# Altium schematic sheet 47. XDS110 DEBUGGER.SchDoc: XDS110 DEBUGGER (part 1 of 3)
size 513 x 386 mm; Project: PROC154E2(001)_SK_AM69; Issue: 1.0; RevCode: E3; Page Create Date: March  8, 1995; Variant Name: Core Design; Schematic Page Number: 47; Page Number: 47; Page Size: C; Comment: MISTRAL_TITLEBLK_CSIZE_1; Page Count: 62; Schematic Page Count: 62; Name: PROC154E2 001 SK AM69; DsnPath: C:\Users\danie\Downloads\sprr466c\PROC154E3_RP\PROC154E3_SCH.DSN; SchematicName: SCHEMATIC1; PageName: 47. XDS110 DEBUGGER; PageSize: C; TopSchematic: True
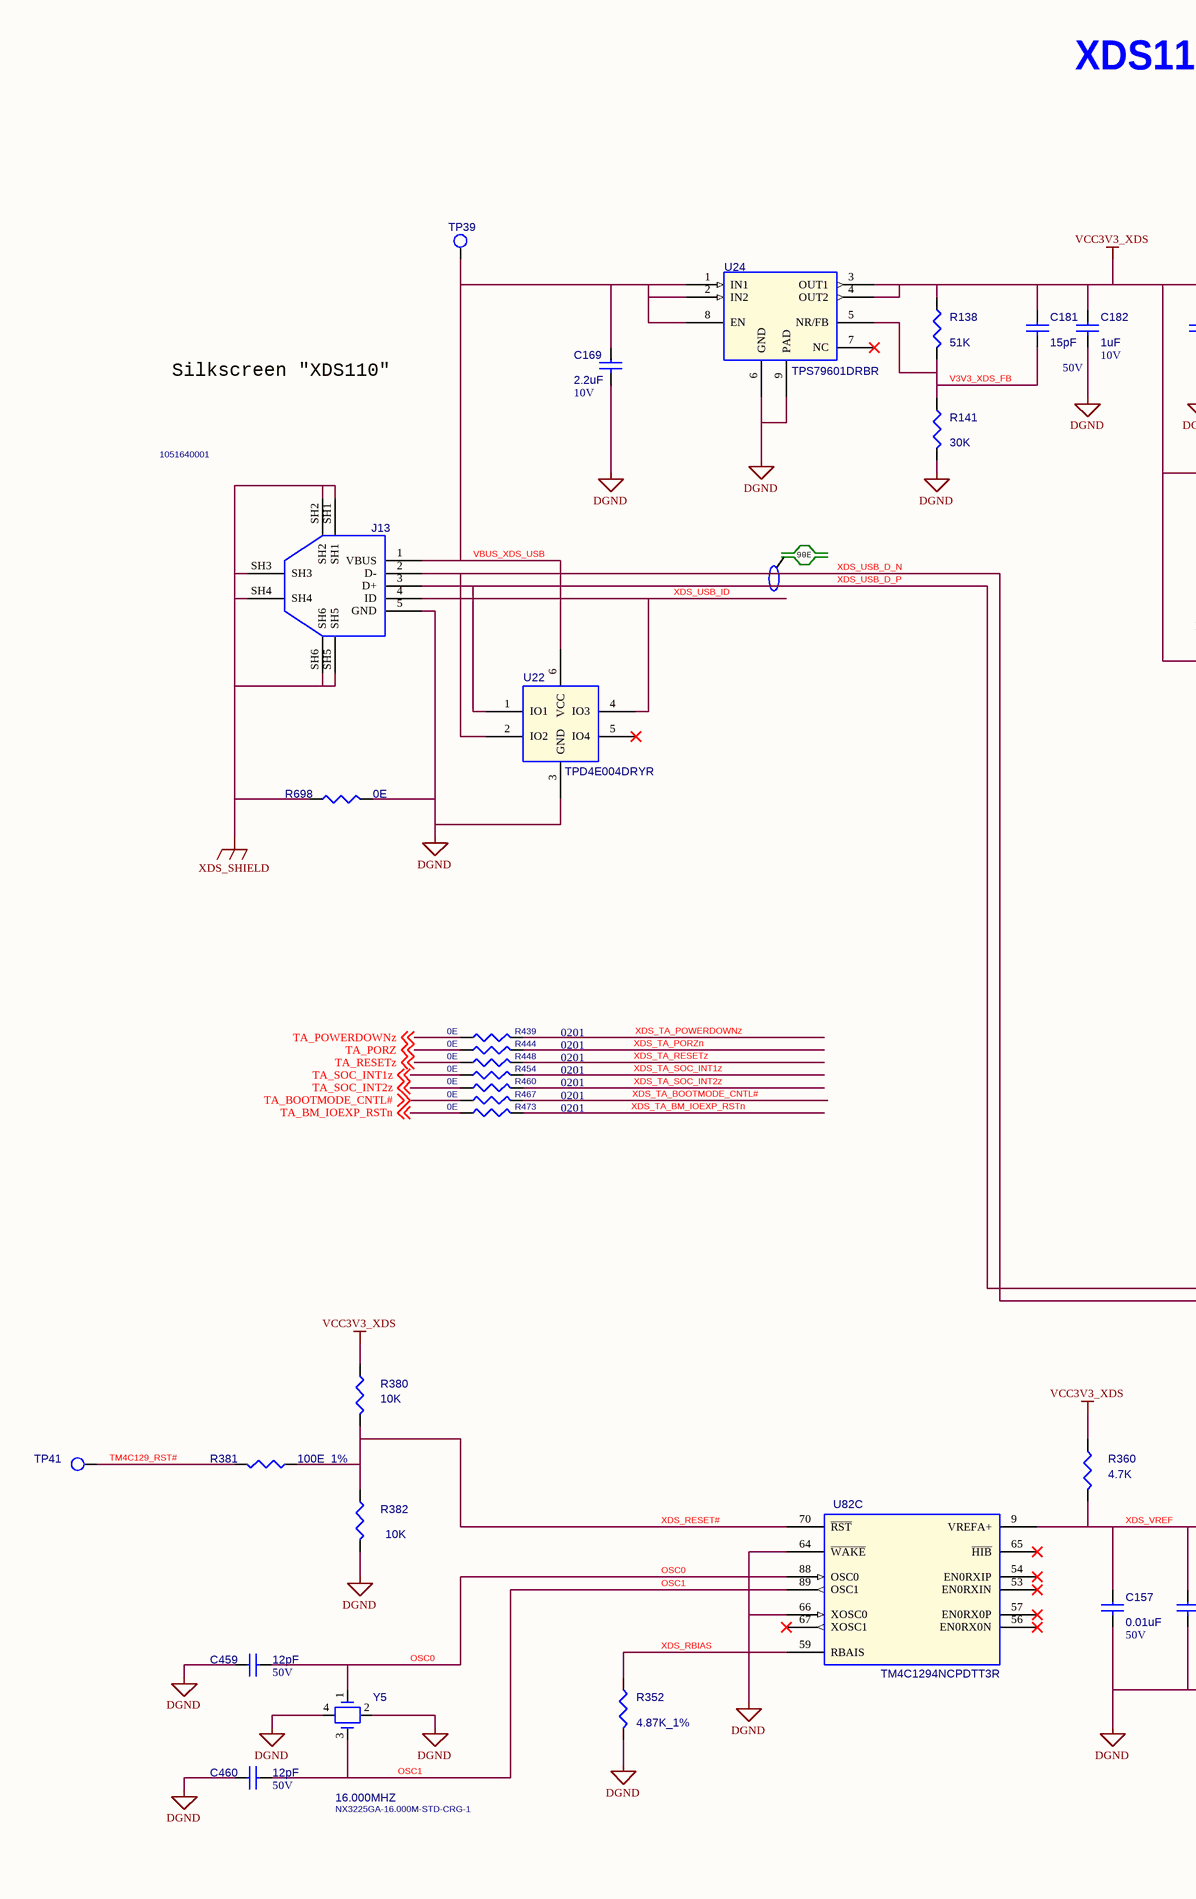
[diagram p0: 47. XDS110 DEBUGGER.SchDoc, left]
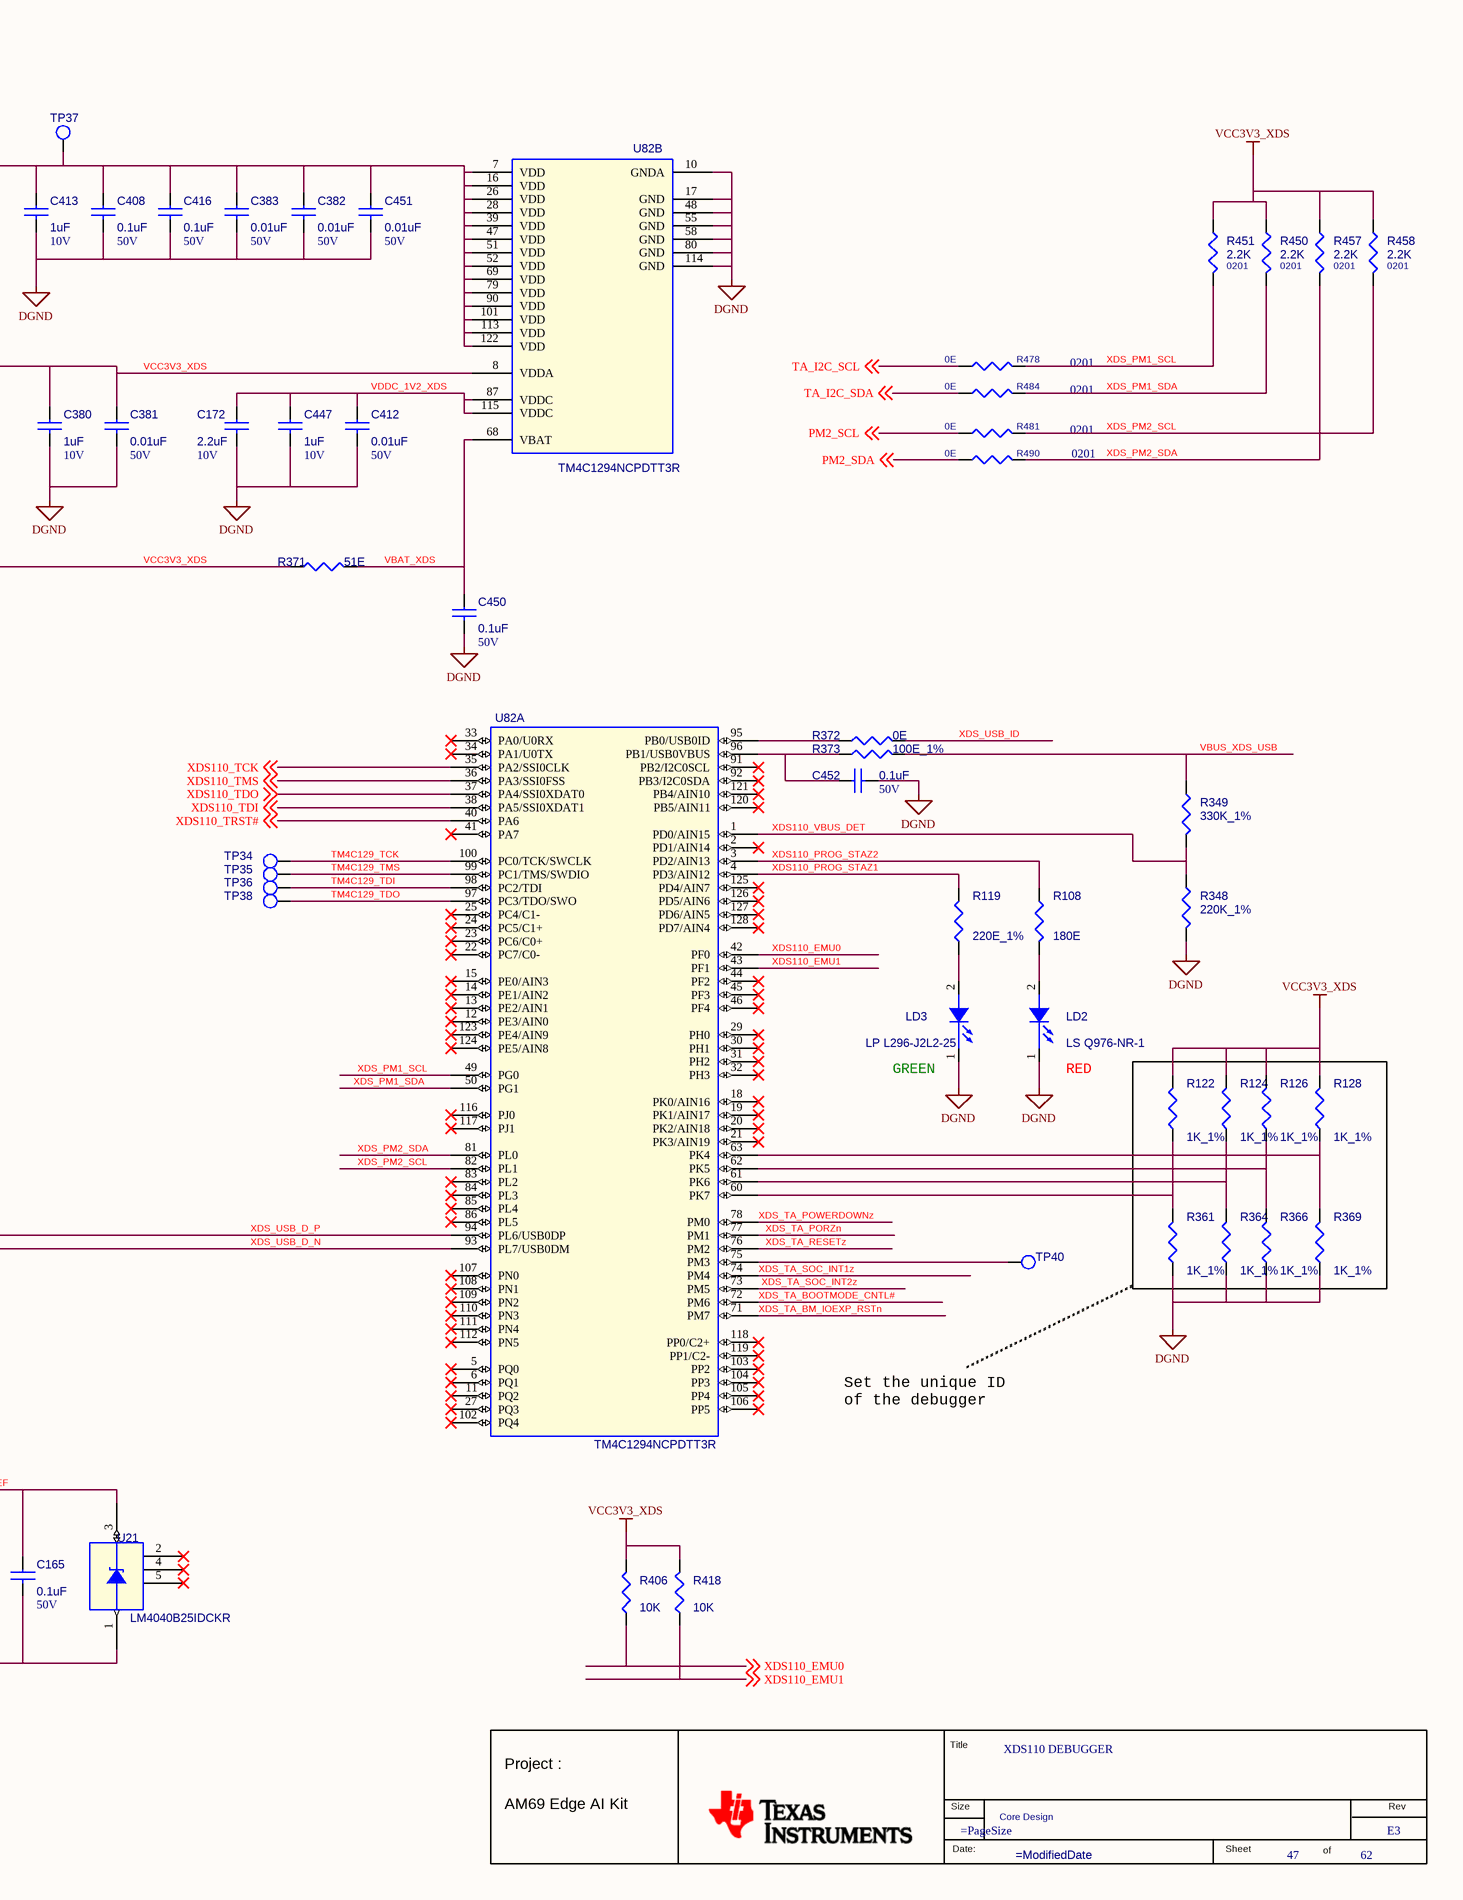
[diagram p1: 47. XDS110 DEBUGGER.SchDoc, right]

## Parts
*  RevCode: E3  Title: XDS110 DEBUGGER  Page Number: 47  Page Count: 62  Variant Name: Core Design  (hidden comment: MISTRAL_TITLEBLK_CSIZE_1)  (graphical)
C157  0.01uF  Voltage: 50V  [CAP0402_0-75]
C165  0.1uF  Voltage: 50V  [CAP0402_0-75]
C169  2.2uF  Voltage: 10V  [CAP0603_1]
C172  2.2uF  Voltage: 10V  [CAP0603_1]
C181  15pF  Voltage: 50V  [CAP0402_0-75]
C182  1uF  Voltage: 10V  [CAP0402_0-75]
C380  1uF  Voltage: 10V  [CAP0402_0-75]
C381  0.01uF  Voltage: 50V  [CAP0402_0-75]
C382  0.01uF  Voltage: 50V  [CAP0402_0-75]
C383  0.01uF  Voltage: 50V  [CAP0402_0-75]
C408  0.1uF  Voltage: 50V  [CAP0402_0-75]
C412  0.01uF  Voltage: 50V  [CAP0402_0-75]
C413  1uF  Voltage: 10V  [CAP0402_0-75]
C416  0.1uF  Voltage: 50V  [CAP0402_0-75]
C447  1uF  Voltage: 10V  [CAP0402_0-75]
C450  0.1uF  Voltage: 50V  [CAP0402_0-75]
C451  0.01uF  Voltage: 50V  [CAP0402_0-75]
C452  0.1uF  Voltage: 50V  [CAP0402_0-75]
C459  12pF  Voltage: 50V  [CAP0402_0-75]
C460  12pF  Voltage: 50V  [CAP0402_0-75]
J13  Mfr_part_number: 1051640001  [CON_MUSBB5_1051640001_S_R_S_2-5]  (hidden comment: CON_MUSB-B_5_F)
LD2  LS Q976-NR-1  [LED_0603_0-8]
LD3  LP L296-J2L2-25  [LED_0603_0-7]
R108  180E  [RES0402_0-5]
R119  220E_1%  [RES0402_0-5]
R122  1K_1%  [RES0402_0-5]
R124  1K_1%  [RES0402_0-5]
R126  1K_1%  [RES0402_0-5]
R128  1K_1%  [RES0402_0-5]
R138  51K  [RES0402_0-5]
R141  30K  [RES0402_0-5]
R348  220K_1%  [RES0402_0-5]
R349  330K_1%  [RES0402_0-5]
R352  4.87K_1%  [RES0402_0-5]
R360  4.7K  [RES0402_0-5]
R361  1K_1%  [RES0402_0-5]
R364  1K_1%  [RES0402_0-5]
R366  1K_1%  [RES0402_0-5]
R369  1K_1%  [RES0402_0-5]
R371  51E  [RES0402_0-5]
R372  0E  [RES0402_0-5]
R373  100E_1%  [RES0402_0-5]
R380  10K  [RES0402_0-5]
R381  100E_1%  [RES0402_0-5]
R382  10K  [RES0402_0-5]
R406  10K  [RES0402_0-5]
R418  10K  [RES0402_0-5]
R439  0E  Package: 0201  [RES0201_0-5]
R444  0E  Package: 0201  [RES0201_0-5]
R448  0E  Package: 0201  [RES0201_0-5]
R450  2.2K  Package: 0201  [RES0201_0-5]
R451  2.2K  Package: 0201  [RES0201_0-5]
R454  0E  Package: 0201  [RES0201_0-5]
R457  2.2K  Package: 0201  [RES0201_0-5]
R458  2.2K  Package: 0201  [RES0201_0-5]
R460  0E  Package: 0201  [RES0201_0-5]
R467  0E  Package: 0201  [RES0201_0-5]
R473  0E  Package: 0201  [RES0201_0-5]
R478  0E  Package: 0201  [RES0201_0-5]
R481  0E  Package: 0201  [RES0201_0-5]
R484  0E  Package: 0201  [RES0201_0-5]
R490  0E  Package: 0201  [RES0201_0-5]
R698  0E  [RES0805_0-75]
TP34  TP30_SMD  [TP30_SMD]  (value not drawn)
TP35  TP30_SMD  [TP30_SMD]  (value not drawn)
TP36  TP30_SMD  [TP30_SMD]  (value not drawn)
TP37  TP30_SMD  [TP30_SMD]  (value not drawn)
TP38  TP30_SMD  [TP30_SMD]  (value not drawn)
TP39  TP30_SMD  [TP30_SMD]  (value not drawn)
TP40  TP30_SMD  [TP30_SMD]  (value not drawn)
TP41  TP30_SMD  [TP30_SMD]  (value not drawn)
U21  LM4040B25IDCKR  [SC70-5_1-1]
U22  TPD4E004DRYR  [SON6_19-68_40X60_PB_0-6]
U24  TPS79601DRBR  [SON8_25-59_130X130_1]
U82  TM4C1294NCPDTT3R  [TQFP128_15-74_550X550_1-2]  (parts A,B,C of 3)
Y5  16.000MHZ  Mfr_part_number: NX3225GA-16.000M-STD-CRG-1  [XTAL4_NX3225GA_130X100_SMD_0-9]

## Nets
DGND: C157.2 C165.2 C169.2 C172.2 C182.2 C380.2 C381.2 C382.2 C383.2 C408.2 C412.2 C413.2 C416.2 C447.2 C450.2 C451.2 C452.2 C459.1 C460.1 J13.5(GND) LD2.1(CATHODE) LD3.1(CATHODE) R141.2 R348.2 R352.2 R361.1 R364.1 R366.1 R369.1 R382.2 R698.2 U21.1(ANODE) U22.3(GND) U24.6(GND) U24.9(PAD) U82.10(GNDA) U82.17(GND) U82.48(GND) U82.55(GND) U82.58(GND) U82.64(~{WAKE}) U82.66(XOSC0) U82.80(GND) U82.114(GND) Y5.2 Y5.4
VCC3V3_XDS: C181.1 C182.1 C380.1 C381.1 C382.1 C383.1 C408.1 C413.1 C416.1 C451.1 R122.2 R124.2 R126.2 R128.2 R138.1 R360.1 R371.1 R380.1 R406.2 R418.2 R450.1 R451.1 R457.1 R458.1 TP37.1(TP) U24.3(OUT1) U24.4(OUT2) U82.7(VDD) U82.8(VDDA) U82.16(VDD) U82.26(VDD) U82.28(VDD) U82.39(VDD) U82.47(VDD) U82.51(VDD) U82.52(VDD) U82.69(VDD) U82.79(VDD) U82.90(VDD) U82.101(VDD) U82.113(VDD) U82.122(VDD)
XDS_SHIELD: J13.SH1 J13.SH2 J13.SH3 J13.SH4 J13.SH5 J13.SH6 R698.1
OSC0: C459.2 U82.88(OSC0) Y5.1
OSC1: C460.2 U82.89(OSC1) Y5.3
PM2_SCL: R481.2 ; off-sheet PM2_SCL
PM2_SDA: R490.2 ; off-sheet PM2_SDA
TA_BM_IOEXP_RSTn: R473.2 ; off-sheet TA_BM_IOEXP_RSTn
TA_BOOTMODE_CNTL#: R467.2 ; off-sheet TA_BOOTMODE_CNTL#
TA_I2C_SCL: R478.2 ; off-sheet TA_I2C_SCL
TA_I2C_SDA: R484.2 ; off-sheet TA_I2C_SDA
TA_PORZ: R444.2 ; off-sheet TA_PORZ
TA_POWERDOWNz: R439.2 ; off-sheet TA_POWERDOWNz
TA_RESETz: R448.2 ; off-sheet TA_RESETz
TA_SOC_INT1z: R454.2 ; off-sheet TA_SOC_INT1z
TA_SOC_INT2z: R460.2 ; off-sheet TA_SOC_INT2z
TM4C129_RST#: R381.2 TP41.1(TP)
TM4C129_TCK: TP34.1(TP) U82.100(PC0/TCK/SWCLK)
TM4C129_TDI: TP36.1(TP) U82.98(PC2/TDI)
TM4C129_TDO: TP38.1(TP) U82.97(PC3/TDO/SWO)
TM4C129_TMS: TP35.1(TP) U82.99(PC1/TMS/SWDIO)
V3V3_XDS_FB: C181.2 R138.2 R141.1 U24.5(NR/FB)
VBAT_XDS: C450.1 R371.2 U82.68(VBAT)
VBUS_XDS_USB: C169.1 J13.1(VBUS) R349.1 R373.2 TP39.1(TP) U22.6(VCC) U24.1(IN1) U24.2(IN2) U24.8(EN)
VDDC_1V2_XDS: C172.1 C412.1 C447.1 U82.87(VDDC) U82.115(VDDC)
XDS110_EMU0: R406.1 U82.42(PF0) ; off-sheet XDS110_EMU0
XDS110_EMU1: R418.1 U82.43(PF1) ; off-sheet XDS110_EMU1
XDS110_PROG_STAZ1: R119.2 U82.4(PD3/AIN12)
XDS110_PROG_STAZ2: R108.1 U82.3(PD2/AIN13)
XDS110_TCK: U82.35(PA2/SSI0CLK) ; off-sheet XDS110_TCK
XDS110_TDI: U82.38(PA5/SSI0XDAT1) ; off-sheet XDS110_TDI
XDS110_TDO: U82.37(PA4/SSI0XDAT0) ; off-sheet XDS110_TDO
XDS110_TMS: U82.36(PA3/SSI0FSS) ; off-sheet XDS110_TMS
XDS110_TRST#: U82.40(PA6) ; off-sheet XDS110_TRST#
XDS110_VBUS_DET: R348.1 R349.2 U82.1(PD0/AIN15)
XDS_PM1_SCL: R451.2 R478.1 U82.49(PG0)
XDS_PM1_SDA: R450.2 R484.1 U82.50(PG1)
XDS_PM2_SCL: R458.2 R481.1 U82.82(PL1)
XDS_PM2_SDA: R457.2 R490.1 U82.81(PL0)
XDS_RBIAS: R352.1 U82.59(RBAIS)
XDS_RESET#: R380.2 R381.1 R382.1 U82.70(~{RST})
XDS_TA_BM_IOEXP_RSTn: R473.1 U82.71(PM7)
XDS_TA_BOOTMODE_CNTL#: R467.1 U82.72(PM6)
XDS_TA_PORZn: R444.1 U82.77(PM1)
XDS_TA_POWERDOWNz: R439.1 U82.78(PM0)
XDS_TA_RESETz: R448.1 U82.76(PM2)
XDS_TA_SOC_INT1z: R454.1 U82.74(PM4)
XDS_TA_SOC_INT2z: R460.1 U82.73(PM5)
XDS_USB_D_N: J13.2(D-) U22.2(IO2) U82.93(PL7/USB0DM)
XDS_USB_D_P: J13.3(D+) U22.1(IO1) U82.94(PL6/USB0DP)
XDS_USB_ID: J13.4(ID) R372.2 U22.4(IO3)
XDS_VREF: C157.1 C165.1 R360.2 U21.3(CATHODE) U82.9(VREFA+)
NetC452_1: C452.1 R373.1 U82.96(PB1/USB0VBUS)
NetLD2_2: LD2.2(ANODE) R108.2
NetLD3_2: LD3.2(ANODE) R119.1
NetR122_1: R122.1 R361.2 U82.60(PK7)
NetR124_1: R124.1 R364.2 U82.61(PK6)
NetR126_1: R126.1 R366.2 U82.62(PK5)
NetR128_1: R128.1 R369.2 U82.63(PK4)
NetR372_1: R372.1 U82.95(PB0/USB0ID)
NetTP40_1: TP40.1(TP) U82.75(PM3)

Not connected (* = marked no-connect by the designer): U21 2(NC1)* 4(NC2)* 5(NC3)*; U22 5(IO4)*; U24 7(NC)*; U82 2(PD1/AIN14)* 5(PQ0)* 6(PQ1)* 11(PQ2)* 12(PE3/AIN0)* 13(PE2/AIN1)* 14(PE1/AIN2)* 15(PE0/AIN3)* 18(PK0/AIN16)* 19(PK1/AIN17)* 20(PK2/AIN18)* 21(PK3/AIN19)* 22(PC7/C0-)* 23(PC6/C0+)* 24(PC5/C1+)* 25(PC4/C1-)* 27(PQ3)* 29(PH0)* 30(PH1)* 31(PH2)* 32(PH3)* 33(PA0/U0RX)* 34(PA1/U0TX)* 41(PA7)* 44(PF2)* 45(PF3)* 46(PF4)* 53(EN0RXIN)* 54(EN0RXIP)* 56(EN0RX0N)* 57(EN0RX0P)* 65(~{HIB})* 67(XOSC1)* 83(PL2)* 84(PL3)* 85(PL4)* 86(PL5)* 91(PB2/I2C0SCL)* 92(PB3/I2C0SDA)* 102(PQ4)* 103(PP2)* 104(PP3)* 105(PP4)* 106(PP5)* 107(PN0)* 108(PN1)* 109(PN2)* 110(PN3)* 111(PN4)* 112(PN5)* 116(PJ0)* 117(PJ1)* 118(PP0/C2+)* 119(PP1/C2-)* 120(PB5/AIN11)* 121(PB4/AIN10)* 123(PE4/AIN9)* 124(PE5/AIN8)* 125(PD4/AIN7)* 126(PD5/AIN6)* 127(PD6/AIN5)* 128(PD7/AIN4)*

## Notes on the sheet
- XDS110 DEBUGGER
- Silkscreen "XDS110"
- 90E
- (near LD3) GREEN
- (near LD2) RED
- Set the unique ID
  of the debugger
- (in symbol MISTRAL_TITLEBLK_CSIZE_1) Title; Project :; Size; Rev; AM69 Edge AI Kit; Date:; Sheet; of